# Altium schematic sheet Serial.SchDoc: Ixora
size A3; Organization: Toradex AG; Address1: Altsagenstrasse 5; Address2: Horw; Address3: 6048; Address4: Switzerland; DocumentNumber: 16; Revision: V1.1; SheetNumber: 16; SheetTotal: 19; PageSetup: Record=PageOptions|CenterHorizontal=True|CenterVertical=True|PrintScale=0.73|XCorrection=1.00|YCorrection=1.00|PrintKind=0|BorderSize=5000000|LeftOffset=0|BottomOffset=0|Orientation=2|PaperLength=1000|PaperWidth=1000|Scale=100|PaperSource=7|PrintQuality=-4|MediaType=1|DitherType=10|PaperKind=A4|PrintScaleMode=1
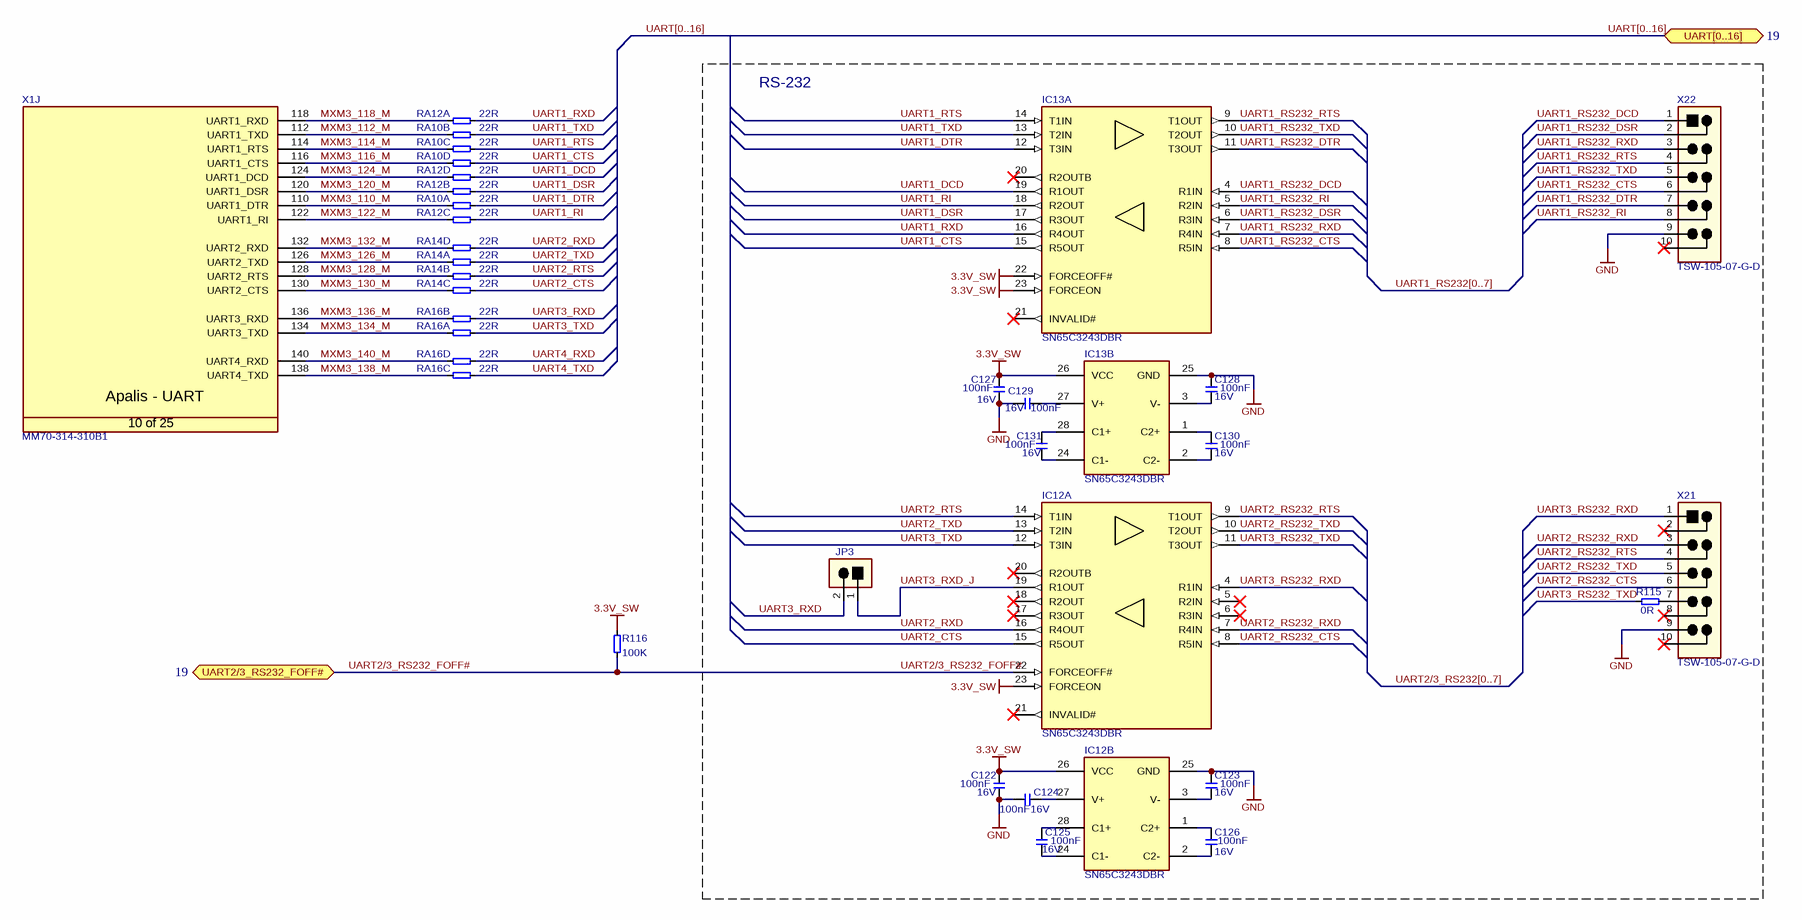
[diagram p0: Serial.SchDoc]

## Parts
C122  Rating: 16V  [CAPC1005X60N]  (hidden comment: 100nF)
C123  Rating: 16V  [CAPC1005X60N]  (hidden comment: 100nF)
C124  Rating: 16V  [CAPC1005X60N]  (hidden comment: 100nF)
C125  Rating: 16V  [CAPC1005X60N]  (hidden comment: 100nF)
C126  Rating: 16V  [CAPC1005X60N]  (hidden comment: 100nF)
C127  Rating: 16V  [CAPC1005X60N]  (hidden comment: 100nF)
C128  Rating: 16V  [CAPC1005X60N]  (hidden comment: 100nF)
C129  Rating: 16V  [CAPC1005X60N]  (hidden comment: 100nF)
C130  Rating: 16V  [CAPC1005X60N]  (hidden comment: 100nF)
C131  Rating: 16V  [CAPC1005X60N]  (hidden comment: 100nF)
IC12  SN65C3243DBR  [SOP65P780X200-28N]  (parts A,B of 2)
IC13  SN65C3243DBR  [SOP65P780X200-28N]  (parts A,B of 2)
JP3  TSW-101-07-G-D  [T_Samtec_TSW-101-07-G-D]  (value not drawn)
R115  0R  [RESC1005X40N]
R116  100K  [RESC1005X40N]
RA10  22R  [T_Resistor_Array_X4]  (parts A,B,C,D of 4)
RA12  22R  [T_Resistor_Array_X4]  (parts A,B,C,D of 4)
RA14  22R  [T_Resistor_Array_X4]  (parts A,B,C,D of 4)
RA16  22R  [T_Resistor_Array_X4]  (parts A,B,C,D of 4)
X1  Manufacturer Part No.: MM70-314-310B1  [T_JAE_MM70-314-310B1]  (hidden comment: CON-JAE-MM70-314-310B1-314-0.5mm)  (part J of 25)
X21  TSW-105-07-G-D  [T_Samtec_TSW-105-07-G-D]
X22  TSW-105-07-G-D  [T_Samtec_TSW-105-07-G-D]

## Blocks framed on the sheet
RS-232: C122-C131 IC12 IC13 JP3 R115 X21 X22

## Ports
UART2/3_RS232_FOFF# (bidir, see 19), UART[0..16] (bidir, see 19)

## Nets
3.3V_SW: C122.2 C127.2 IC12.23(FORCEON) IC12.26(VCC) IC13.22(FORCEOFF#) IC13.23(FORCEON) IC13.26(VCC) R116.2
GND: C122.1 C123.2 C124.1 C127.1 C128.2 C129.1 IC12.25(GND) IC13.25(GND) X21.9 X22.9
MXM3_110_M: RA10.1 X1.110(UART1_DTR)
MXM3_112_M: RA10.2 X1.112(UART1_TXD)
MXM3_114_M: RA10.3 X1.114(UART1_RTS)
MXM3_116_M: RA10.4 X1.116(UART1_CTS)
MXM3_118_M: RA12.1 X1.118(UART1_RXD)
MXM3_120_M: RA12.2 X1.120(UART1_DSR)
MXM3_122_M: RA12.3 X1.122(UART1_RI)
MXM3_124_M: RA12.4 X1.124(UART1_DCD)
MXM3_126_M: RA14.1 X1.126(UART2_TXD)
MXM3_128_M: RA14.2 X1.128(UART2_RTS)
MXM3_130_M: RA14.3 X1.130(UART2_CTS)
MXM3_132_M: RA14.4 X1.132(UART2_RXD)
MXM3_134_M: RA16.1 X1.134(UART3_TXD)
MXM3_136_M: RA16.2 X1.136(UART3_RXD)
MXM3_138_M: RA16.3 X1.138(UART4_TXD)
MXM3_140_M: RA16.4 X1.140(UART4_RXD)
UART1_CTS: IC13.15(R5OUT) RA10.8
UART1_DCD: IC13.19(R1OUT) RA12.8
UART1_DSR: IC13.17(R3OUT) RA12.6
UART1_DTR: IC13.12(T3IN) RA10.5
UART1_RI: IC13.18(R2OUT) RA12.7
UART1_RS232_CTS: IC13.8(R5IN) X22.6
UART1_RS232_DCD: IC13.4(R1IN) X22.1
UART1_RS232_DSR: IC13.6(R3IN) X22.2
UART1_RS232_DTR: IC13.11(T3OUT) X22.7
UART1_RS232_RI: IC13.5(R2IN) X22.8
UART1_RS232_RTS: IC13.9(T1OUT) X22.4
UART1_RS232_RXD: IC13.7(R4IN) X22.3
UART1_RS232_TXD: IC13.10(T2OUT) X22.5
UART1_RTS: IC13.14(T1IN) RA10.7
UART1_RXD: IC13.16(R4OUT) RA12.5
UART1_TXD: IC13.13(T2IN) RA10.6
UART2/3_RS232_FOFF#: IC12.22(FORCEOFF#) R116.1 ; port UART2/3_RS232_FOFF#
UART2_CTS: IC12.15(R5OUT) RA14.7
UART2_RS232_CTS: IC12.8(R5IN) X21.6
UART2_RS232_RTS: IC12.9(T1OUT) X21.4
UART2_RS232_RXD: IC12.7(R4IN) X21.3
UART2_RS232_TXD: IC12.10(T2OUT) X21.5
UART2_RTS: IC12.14(T1IN) RA14.6
UART2_RXD: IC12.16(R4OUT) RA14.8
UART2_TXD: IC12.13(T2IN) RA14.5
UART3_RS232_RXD: IC12.4(R1IN) X21.1
UART3_RS232_TXD: IC12.11(T3OUT) R115.1
UART3_RXD: JP3.2 RA16.6
UART3_RXD_J: IC12.19(R1OUT) JP3.1
UART3_TXD: IC12.12(T3IN) RA16.5
UART4_RXD: RA16.8
UART4_TXD: RA16.7
NetC123_1: C123.1 IC12.3(V-)
NetC124_2: C124.2 IC12.27(V+)
NetC125_1: C125.1 IC12.24(C1-)
NetC125_2: C125.2 IC12.28(C1+)
NetC126_1: C126.1 IC12.2(C2-)
NetC126_2: C126.2 IC12.1(C2+)
NetC128_1: C128.1 IC13.3(V-)
NetC129_2: C129.2 IC13.27(V+)
NetC130_1: C130.1 IC13.2(C2-)
NetC130_2: C130.2 IC13.1(C2+)
NetC131_1: C131.1 IC13.24(C1-)
NetC131_2: C131.2 IC13.28(C1+)
NetR115_2: R115.2 X21.7

Not connected (* = marked no-connect by the designer): IC12 5(R2IN)* 6(R3IN)* 17(R3OUT)* 18(R2OUT)* 20(R2OUTB)* 21(INVALID#)*; IC13 20(R2OUTB)* 21(INVALID#)*; X21 2* 8* 10*; X22 10*

## Buses and harness runs
bus UART1_RS232[0..7]
bus UART2/3_RS232[0..7]
bus UART[0..16] = port UART[0..16]

## Notes on the sheet
- Title
- Size:
- Date:
- A3
- Number:
- Time:
- Revision:
- Sheet
- of
- File:
- (in symbol CON-JAE-MM70-314-310B1-314-0.5mm, part J) Apalis - UART; 10 of 25

## Library data of the parts
C122-C131 = C-X7R-100nF-16V-10%-0402: Capacitor Ceramic X7R 100nF 16V 10% 0402; Tolerance: 10%; Type: X7R; Value: 100nF
IC12 IC13 = IC-TI-SN65C3243DBR: RS-232 Serial Transceiver; Manufacturer Name: Texas Instruments; Manufacturer Part No.: SN65C3243DBR
JP3 = CON-Samtec-TSW-101-07-G-D: Header male, 1x2 Pins, 2.54 mm pitch; Manufacturer Name: Samtec; Pitch: 2.54 mm; No. of ways: 1x2; Manufacturer Part no.: TSW-101-07-G-D
R115 = R-0R-63mW-1%-0402: Resistor 0 ohm 63mW 1% 0402; Tolerance: 1%; Value: 0R; Rating: 63mW
R116 = R-100KR-63mW-5%-0402: Resistor 100 Kohm 63mW 5% 0402; Value: 100KR; Rating: 63mW; Tolerance: 5%
RA10 RA12 RA14 RA16 = RA-22R-63mW-5%-1206-div: Resistor Array 22 R 63mW 5% 1206; Tolerance: 5%; Power Dissipation: 63mW; Value: 22R
X1 = CON-JAE-MM70-314-310B1-314-0.5mm: MXM3 Connector; Manufacturer Name: JAE; No. of ways: 314
X21 X22 = CON-Samtec-TSW-105-07-G-D: Header Male, 2x5 Pins, 2.54mm pitch; Manufacturer Name: Samtec; No. of. ways: 2x5; Pitch: 2.54mm; Manufacturer Part No.: TSW-105-07-G-D